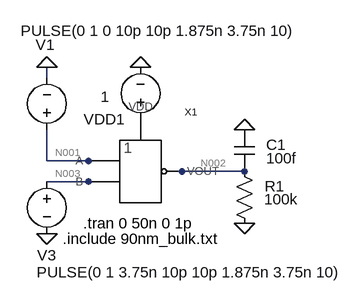
[diagram p0: schematic NOR_test.asc]
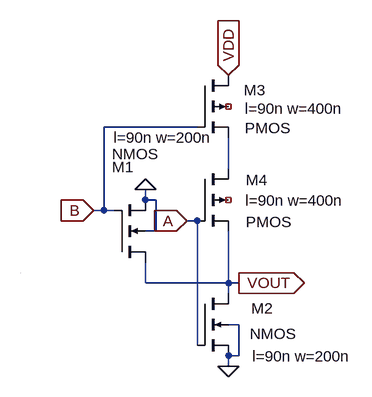
[diagram p1: sub-circuit nor.asc]
NOR_test.asc, the LTspice schematic file:
Version 4
SHEET 1 880 680
WIRE 0 32 0 16
WIRE 0 160 0 112
WIRE 64 160 0 160
WIRE 112 160 64 160
WIRE 208 176 192 176
WIRE 304 176 208 176
WIRE 64 192 0 192
WIRE 112 192 64 192
FLAG 304 256 0
FLAG 304 112 0
FLAG 144 16 0
FLAG 0 272 0
FLAG 0 16 0
SYMBOL NOR 112 176 R0
SYMATTR InstName X1
SYMBOL voltage 0 176 R0
WINDOW 0 -17 -195 Left 2
WINDOW 3 -16 155 Left 2
WINDOW 123 0 0 Left 0
WINDOW 39 0 0 Left 0
SYMATTR InstName V1
SYMATTR Value PULSE(0 1 3.75n 10p 10p 1.875n 3.75n 10)
SYMBOL res 288 160 R0
WINDOW 0 47 39 Left 2
WINDOW 3 46 59 Left 2
SYMATTR InstName R1
SYMATTR Value 100k
SYMBOL cap 288 112 R0
WINDOW 0 49 23 Left 2
WINDOW 3 49 44 Left 2
SYMATTR InstName C1
SYMATTR Value 100f
SYMBOL voltage 144 112 R180
WINDOW 3 48 51 Left 2
WINDOW 123 0 0 Left 0
WINDOW 39 0 0 Left 0
SYMATTR Value 1
SYMATTR InstName VDD1
SYMBOL voltage 0 128 R180
WINDOW 0 -14 -177 Left 2
WINDOW 3 -385 168 Left 2
WINDOW 123 0 0 Left 0
WINDOW 39 0 0 Left 0
SYMATTR InstName V3
SYMATTR Value PULSE(0 1 0 10p 10p 1.875n 3.75n 10)
TEXT 24 280 Left 2 !.include 90nm_bulk.txt
TEXT 56 256 Left 2 !.tran 0 50n 0 1p

nor.asc, the sub-circuit schematic file:
Version 4
SHEET 1 880 680
WIRE 272 -224 128 -224
WIRE 320 -160 320 -208
WIRE 192 -112 192 -128
WIRE 208 -112 192 -112
WIRE 128 -96 128 -224
WIRE 128 -96 112 -96
WIRE 144 -96 128 -96
WIRE 272 -80 256 -80
WIRE 208 -64 208 -112
WIRE 208 -64 192 -64
WIRE 192 16 192 -16
WIRE 320 16 320 -64
WIRE 320 16 192 16
WIRE 336 16 320 16
WIRE 320 32 320 16
WIRE 336 80 320 80
WIRE 272 112 272 -80
WIRE 336 128 336 80
WIRE 336 128 320 128
WIRE 320 144 320 128
WIRE 0 0 0 0
FLAG 192 -128 0
FLAG 320 144 0
FLAG 256 -80 A
IOPIN 256 -80 In
FLAG 112 -96 B
IOPIN 112 -96 In
FLAG 336 16 VOUT
IOPIN 336 16 Out
FLAG 320 -304 VDD
IOPIN 320 -304 In
SYMBOL nmos4 144 -16 M180
WINDOW 123 -1 192 Left 2
WINDOW 0 -3 147 Left 2
WINDOW 3 -3 167 Left 2
SYMATTR Value2 l=90n w=200n
SYMATTR InstName M1
SYMBOL nmos4 272 32 R0
WINDOW 123 85 97 Left 2
WINDOW 0 83 23 Left 2
WINDOW 3 81 62 Left 2
SYMATTR Value2 l=90n w=200n
SYMATTR InstName M2
SYMBOL pmos4 272 -304 R0
WINDOW 123 73 51 Left 2
WINDOW 0 72 23 Left 2
WINDOW 3 73 81 Left 2
SYMATTR Value2 l=90n w=400n
SYMATTR InstName M3
SYMBOL pmos4 272 -160 R0
WINDOW 123 74 49 Left 2
WINDOW 0 75 17 Left 2
WINDOW 3 75 82 Left 2
SYMATTR Value2 l=90n w=400n
SYMATTR InstName M4

The netlist it stands for:
* NOR_test.asc
XX1 N001 N003 N002 P001 nor
V1 N003 0 PULSE(0 1 3.75n 10p 10p 1.875n 3.75n 10)
R1 N002 0 100k
C1 0 N002 100f
VDD1 P001 0 1
V3 N001 0 PULSE(0 1 0 10p 10p 1.875n 3.75n 10)

* block symbol definitions
.subckt nor A B VOUT VDD
M1 VOUT B 0 0 NMOS l=90n w=200n
M2 VOUT A 0 0 NMOS l=90n w=200n
M3 VDD B N001 NC_01 PMOS l=90n w=400n
M4 N001 A VOUT NC_02 PMOS l=90n w=400n
.ends nor

.model NMOS NMOS
.model PMOS PMOS
.lib standard.mos
.include 90nm_bulk.txt
.tran 0 50n 0 1p
.backanno
.end

* Results of the author's LTspice run, read from the files saved beside the schematic
* Operating Point, zero values left out:
*   V(n002) = 948 mV
*   V(p001) = 1 V
*   I(R1) = 9.48 µA
*   I(V3) = 94.56 pA
*   I(Vdd1) = -9.489 µA
*   I(V1) = 94.9 pA
*   Ix(x1:A) = -94.56 pA
*   Ix(x1:B) = -94.9 pA
*   Ix(x1:VOUT) = -9.48 µA
*   Ix(x1:VDD) = 9.489 µA
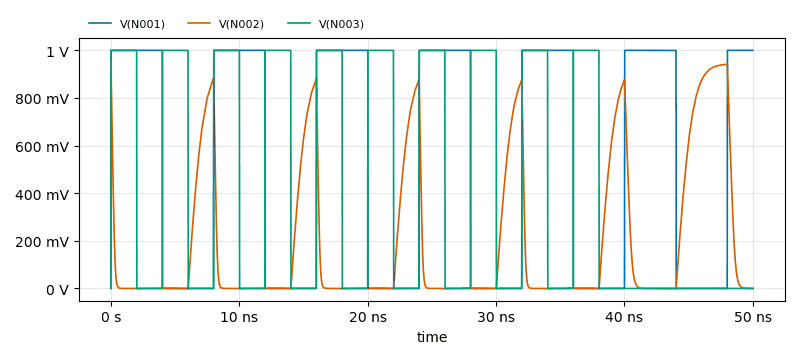
[diagram p2: Transient Analysis of NOR_test.asc, plotted from the saved traces]
* Transient Analysis, 1 run:
*   V(N001): min 0 V, max 1 V, average 521.1 mV, rms 721.6 mV, last 1 V
*   V(N002): min -1.529 mV, max 950.5 mV, average 197.8 mV, rms 375.2 mV, last 77.05 µV
*   V(N003): min 0 V, max 1 V, average 402 mV, rms 633.5 mV, last 0 V